# EAGLE design EveryCook_Mainboard (EAGLE 6.4)
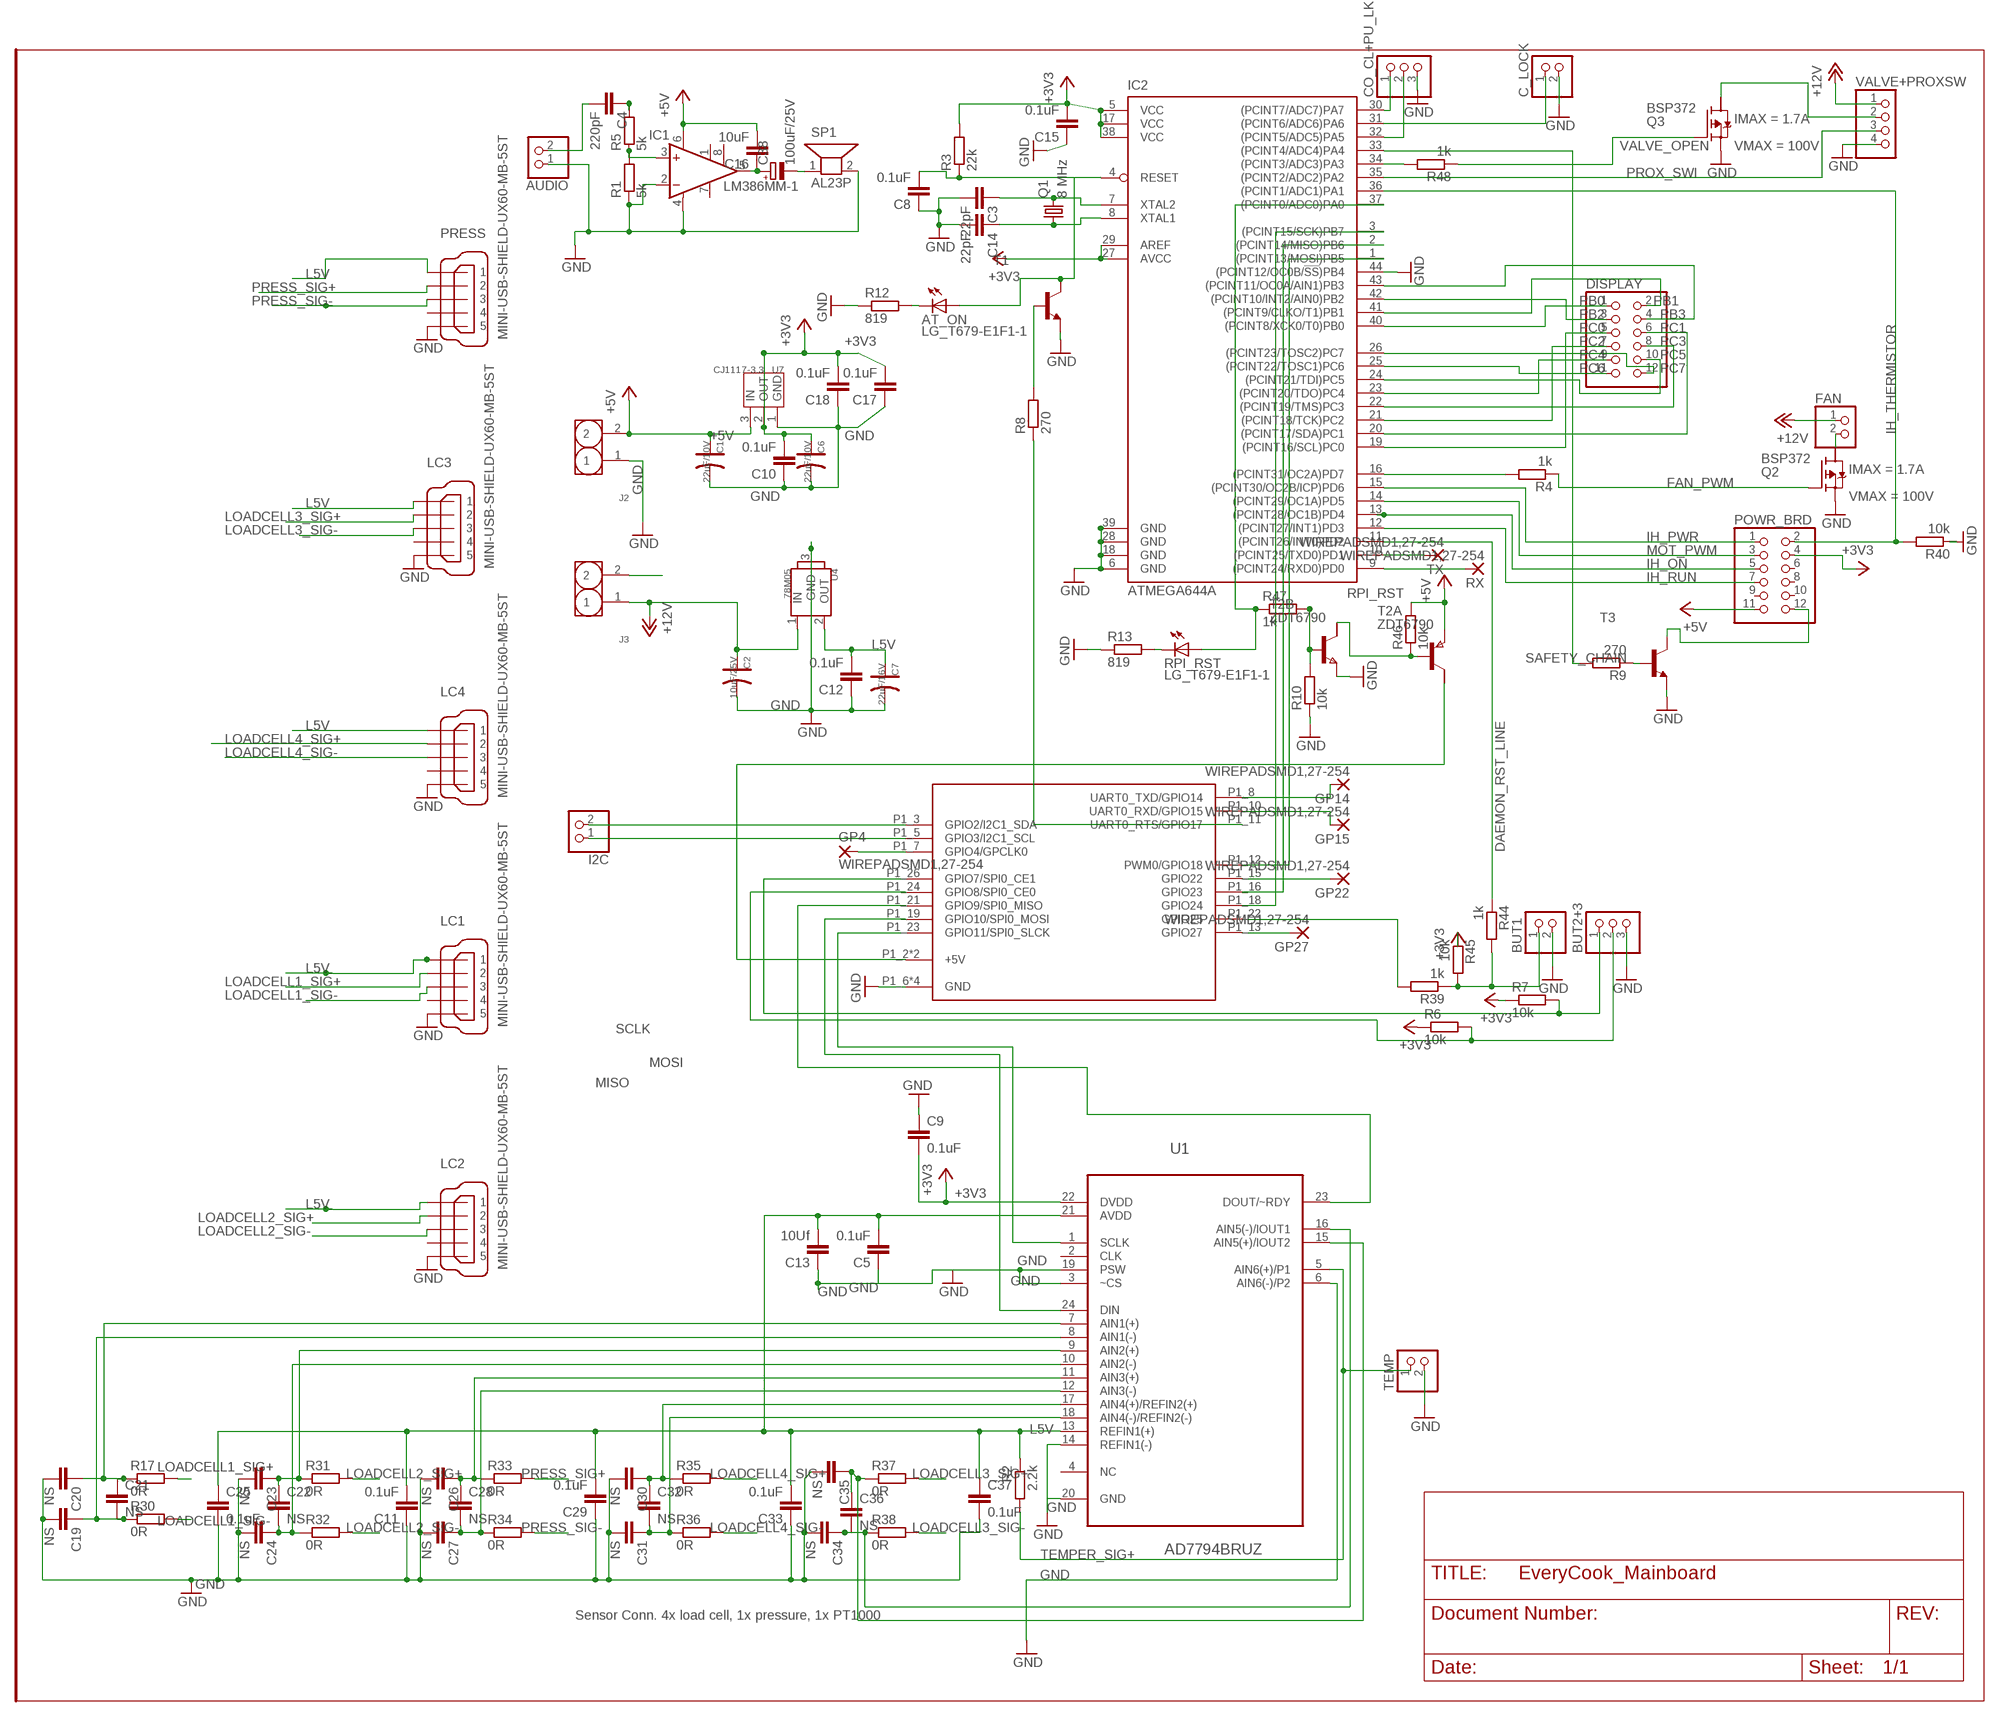
[diagram p0: schematic, sheet 1]

## Parts
AT_ON  LG_T679-E1F1-1  [PLCC2]
AUDIO  PINHD-1X2  [1X02]
BUT1  PINHD-1X2  [1X02]
BUT2+3  PINHD-1X3  [1X03]
C1  22uF/10V  CAP-AVX-A  [AVX-A]
C2  10uF/25V  CAP-ELECTRO-B  [ELECTRO-SMD-B-4.8MM]
C3  22pF  C-EUC0805  [C0805]
C4  220pF  C-EUC0805  [C0805]
C5  0.1uF  C-EUC0805  [C0805]
C6  22uF/10V  CAP-AVX-A  [AVX-A]
C7  22uF/16V  CAP-ELECTRO-B  [ELECTRO-SMD-B-4.8MM]
C8  0.1uF  C-EUC0805  [C0805]
C9  0.1uF  C-EUC0805  [C0805]
C10  0.1uF  C-EUC0805  [C0805]
C11  0.1uF  C-EUC0805  [C0805]
C12  0.1uF  C-EUC0805  [C0805]
C13  10Uf  C-EUC0805  [C0805]
C14  22pF  C-EUC0805  [C0805]
C15  0.1uF  C-EUC0805  [C0805]
C16  10uF  C-EUC0805  [C0805]
C17  0.1uF  C-EUC0805  [C0805]
C18  0.1uF  C-EUC0805  [C0805]
C19  NS  C-EUC0805  [C0805]
C20  NS  C-EUC0805  [C0805]
C21  NS  C-EUC0805  [C0805]
C22  NS  C-EUC0805  [C0805]
C23  NS  C-EUC0805  [C0805]
C24  NS  C-EUC0805  [C0805]
C25  0.1uF  C-EUC0805  [C0805]
C26  NS  C-EUC0805  [C0805]
C27  NS  C-EUC0805  [C0805]
C28  NS  C-EUC0805  [C0805]
C29  0.1uF  C-EUC0805  [C0805]
C30  NS  C-EUC0805  [C0805]
C31  NS  C-EUC0805  [C0805]
C32  NS  C-EUC0805  [C0805]
C33  0.1uF  C-EUC0805  [C0805]
C34  NS  C-EUC0805  [C0805]
C35  NS  C-EUC0805  [C0805]
C36  NS  C-EUC0805  [C0805]
C37  0.1uF  C-EUC0805  [C0805]
C38  100uF/25V  CPOL-EUUD-6,3X7,7  [UD-6,3X7,7_NICHICON]
C_LOCK  PINHD-1X2  [1X02]
CO_CL+PU_LK  PINHD-1X3  [1X03]
DISPLAY  PINHD-2X6  [2X06]
FAN  PINHD-1X2  [1X02]
GP4  WIREPADSMD1,27-254  [SMD1,27-2,54]
GP14  WIREPADSMD1,27-254  [SMD1,27-2,54]
GP15  WIREPADSMD1,27-254  [SMD1,27-2,54]
GP22  WIREPADSMD1,27-254  [SMD1,27-2,54]
GP27  WIREPADSMD1,27-254  [SMD1,27-2,54]
I2C  PINHD-1X2  [1X02]
IC1  LM386MM-1  [MMSOP08]
IC2  ATMEGA644A  [TQFP44]
J2  HEADER-2P-5.0  [2P-5.0]
J3  HEADER-2P-5.0  [2P-5.0]
LC1  MINI-USB-SHIELD-UX60-MB-5ST  [UX60-MB-5ST]
LC2  MINI-USB-SHIELD-UX60-MB-5ST  [UX60-MB-5ST]
LC3  MINI-USB-SHIELD-UX60-MB-5ST  [UX60-MB-5ST]
LC4  MINI-USB-SHIELD-UX60-MB-5ST  [UX60-MB-5ST]
POWR_BRD  PINHD-2X6  [2X06]
PRESS  MINI-USB-SHIELD-UX60-MB-5ST  [UX60-MB-5ST]
Q1  8 MHz  CRYSTALHC49UP  [HC49UP]
Q2  BSP372  BSP613P  [PG-SOT-223]
Q3  BSP372  BSP613P  [PG-SOT-223]
R1  5k  R-EU_R0805  [R0805]
R2  2.2k  R-EU_R0805  [R0805]
R3  22k  R-EU_R0805  [R0805]
R4  1k  R-EU_R0805  [R0805]
R5  5k  R-EU_R0805  [R0805]
R6  10k  R-EU_R0805  [R0805]
R7  10k  R-EU_R0805  [R0805]
R8  270  R-EU_R0805  [R0805]
R9  270  R-EU_R0805  [R0805]
R10  10k  R-EU_R0805  [R0805]
R12  819  R-EU_R0805  [R0805]
R13  819  R-EU_R0805  [R0805]
R17  0R  R-EU_R0805  [R0805]
R30  0R  R-EU_R0805  [R0805]
R31  0R  R-EU_R0805  [R0805]
R32  0R  R-EU_R0805  [R0805]
R33  0R  R-EU_R0805  [R0805]
R34  0R  R-EU_R0805  [R0805]
R35  0R  R-EU_R0805  [R0805]
R36  0R  R-EU_R0805  [R0805]
R37  0R  R-EU_R0805  [R0805]
R38  0R  R-EU_R0805  [R0805]
R39  1k  R-EU_R0805  [R0805]
R40  10k  R-EU_R0805  [R0805]
R44  1k  R-EU_R0805  [R0805]
R45  10k  R-EU_R0805  [R0805]
R46  10k  R-EU_R0805  [R0805]
R47  1k  R-EU_R0805  [R0805]
R48  1k  R-EU_R0805  [R0805]
RPI_RST  LG_T679-E1F1-1  [PLCC2]
RX  WIREPADSMD1,27-254  [SMD1,27-2,54]
SP1  AL23P  [AL23P]
T1  MMBT2222ALT1-NPN-SOT23-BEC  [SOT23-BEC]
T2  ZDT6790  NPN_PNPSM8  [SM8]
T3  MMBT2222ALT1-NPN-SOT23-BEC  [SOT23-BEC]
TEMP  PINHD-1X2  [1X02]
TX  WIREPADSMD1,27-254  [SMD1,27-2,54]
U1  AD7794BRUZ  [SOP65P640X120-24N]
U4  78M05  78M05-TO252  [TO252]
U7  CJ1117-3.3  LD1117SOT89  [SOT89]
U$5  RPI-B-V2  [RPI-B-V2]
VALVE+PROXSW  PINHD-1X4  [1X04]

## Nets
+3V3: C6.+ C9.2 C10.2 C15.2 C17.2 C18.2 IC2.5(VCC) IC2.17(VCC) IC2.27(AVCC) IC2.29(AREF) IC2.38(VCC) POWR_BRD.4 R3.2 R6.1 R7.1 R45.1 U1.22(DVDD) U7.2(OUT) U7.4(TAB)
+5V: C1.+ C16.2 IC1.6(VS) J2.2 POWR_BRD.11 R46.2 T2.1(A:E) U7.3(IN)
+12V: C2.+ FAN.1 J3.1 U4.1(IN) VALVE+PROXSW.1
AT_MISO: IC2.2((PCINT14/MISO)PB6) U$5.P1_16(GPIO23)
AT_MOSI: IC2.1((PCINT13/MOSI)PB5) U$5.P1_12(PWM0/GPIO18)
ATMEL_RST: AT_ON.A C8.2 IC2.4(RESET) R3.1 T1.C
C_CLOSE: CO_CL+PU_LK.1 IC2.30((PCINT7/ADC7)PA7)
DAEMON_RST_LINE: IC2.11((PCINT26/INT0)PD2) R44.1
FAN_PWM: Q2.1(G) R4.1
GND: AUDIO.1 BUT1.2 BUT2+3.3 C1.- C2.- C3.2 C5.1 C6.- C7.- C8.1 C9.1 C10.1 C11.1 C12.1 C13.1 C14.2 C15.1 C17.1 C18.1 C19.2 C20.2 C23.2 C24.2 C25.2 C26.2 C27.2 C29.1 C30.2 C31.2 C33.1 C34.2 C35.2 C37.2 C_LOCK.2 CO_CL+PU_LK.3 IC1.2(-IN) IC1.4(GND) IC2.6(GND) IC2.18(GND) IC2.28(GND) IC2.39(GND) IC2.44((PCINT12/OC0B/!SS!)PB4) J2.1 LC1.5 LC2.5 LC3.5 LC4.5 PRESS.5 Q2.3(S) Q3.3(S) R1.1 R10.1 R12.1 R13.1 R40.1 SP1.2 T1.E T2.3(B:E) T3.E TEMP.2 U1.3(~CS) U1.6(AIN6(-)/P2) U1.14(REFIN1(-)) U1.19(PSW) U1.20(GND) U4.3(GND) U7.1(GND) U$5.P1_6(GND) U$5.P1_14(GND) U$5.P1_20(GND) U$5.P1_25(GND) VALVE+PROXSW.4
IH_ON: IC2.13((PCINT28/OC1B)PD4) POWR_BRD.5
IH_PWR: IC2.15((PCINT30/OC2B/ICP)PD6) POWR_BRD.1
IH_RUN: IC2.12((PCINT27/INT1)PD3) POWR_BRD.7
IH_THERMISTOR: IC2.36((PCINT1/ADC1)PA1) POWR_BRD.2 R40.2
L5V: C5.2 C7.+ C11.2 C12.2 C13.2 C25.1 C29.2 C33.2 C37.1 LC1.1 LC2.1 LC3.1 LC4.1 PRESS.1 R2.1 U1.13(REFIN1(+)) U1.21(AVDD) U4.2(OUT)
LOADCELL1_SIG+: LC1.2 R17.2
LOADCELL1_SIG-: LC1.3 R30.2
LOADCELL2_SIG+: LC2.2 R31.2
LOADCELL2_SIG-: LC2.3 R32.2
LOADCELL3_SIG+: LC3.2 R37.2
LOADCELL3_SIG-: LC3.3 R38.2
LOADCELL4_SIG+: LC4.2 R35.2
LOADCELL4_SIG-: LC4.3 R36.2
MISO: U1.23(DOUT/~RDY) U$5.P1_21(GPIO9/SPI0_MISO)
MOSI: U1.24(DIN) U$5.P1_19(GPIO10/SPI0_MOSI)
MOT_PWM: IC2.14((PCINT29/OC1A)PD5) POWR_BRD.3
N$1: I2C.1 U$5.P1_5(GPIO3/I2C1_SCL)
N$2: C3.1 IC2.7(XTAL2) Q1.2
N$3: C4.1 R5.2
N$5: C34.1 C36.2 R38.1 U1.16(AIN5(-)/IOUT1)
N$6: I2C.2 U$5.P1_3(GPIO2/I2C1_SDA)
N$7: C14.1 IC2.8(XTAL1) Q1.1
N$8: POWR_BRD.12 T3.C
N$9: C20.1 C21.1 R17.1 U1.7(AIN1(+))
N$10: IC2.16((PCINT31/OC2A)PD7) R4.2
N$11: R9.1 T3.B
N$12: IC2.10((PCINT25/TXD0)PD1) TX.1(P)
N$14: IC1.3(+IN) R1.2 R5.1
N$15: IC2.9((PCINT24/RXD0)PD0) RX.1(P)
N$16: GP4.1(P) U$5.P1_7(GPIO4/GPCLK0)
N$17: GP27.1(P) U$5.P1_13(GPIO27)
N$18: GP22.1(P) U$5.P1_15(GPIO22)
N$19: GP15.1(P) U$5.P1_10(UART0_RXD/GPIO15)
N$21: GP14.1(P) U$5.P1_8(UART0_TXD/GPIO14)
N$22: C16.1 C38.+ IC1.5(OUT)
N$23: C38.- SP1.1
N$24: C22.1 C23.1 R31.1 U1.9(AIN2(+))
N$26: R8.2 T1.B
N$27: AUDIO.2 C4.2
N$32: AT_ON.C R12.2
N$34: R13.2 RPI_RST.C
N$42: C22.2 C24.1 R32.1 U1.10(AIN2(-))
N$44: C27.1 C28.2 R34.1 U1.12(AIN3(-))
N$45: C30.1 C32.1 R35.1 U1.17(AIN4(+)/REFIN2(+))
N$46: C31.1 C32.2 R36.1 U1.18(AIN4(-)/REFIN2(-))
N$47: C35.1 C36.1 R37.1 U1.15(AIN5(+)/IOUT2)
N$48: C19.1 C21.2 R30.1 U1.8(AIN1(-))
N$51: FAN.2 Q2.2(D)
N$53: C26.1 C28.1 R33.1 U1.11(AIN3(+))
N$58: T2.8(A:C1) U$5.P1_2(+5V) U$5.P1_4(+5V)
N$60: C_LOCK.1 IC2.31((PCINT6/ADC6)PA6)
N$62: BUT2+3.1 R7.2 U$5.P1_26(GPIO7/SPI0_CE1)
N$63: BUT2+3.2 R6.2 U$5.P1_24(GPIO8/SPI0_CE0)
N$64: R39.2 U$5.P1_22(GPIO25)
N$65: IC2.34((PCINT3/ADC3)PA3) R48.2
N$66: BUT1.1 R39.1 R44.2 R45.2
N$71: R10.2 R47.2 T2.4(B:B)
N$72: R46.1 T2.2(A:B) T2.5(B:C1)
N$77: Q3.2(D) VALVE+PROXSW.2
P_LOCK: CO_CL+PU_LK.2 IC2.32((PCINT5/ADC5)PA5)
PB0: DISPLAY.1 IC2.40((PCINT8/XCK0/T0)PB0)
PB1: DISPLAY.2 IC2.41((PCINT9/CLKO/T1)PB1)
PB2: DISPLAY.3 IC2.42((PCINT10/INT2/AIN0)PB2)
PB3: DISPLAY.4 IC2.43((PCINT11/OC0A/AIN1)PB3)
PC0: DISPLAY.5 IC2.19((PCINT16/SCL)PC0)
PC1: DISPLAY.6 IC2.20((PCINT17/SDA)PC1)
PC2: DISPLAY.7 IC2.21((PCINT18/TCK)PC2)
PC3: DISPLAY.8 IC2.22((PCINT19/TMS)PC3)
PC4: DISPLAY.9 IC2.23((PCINT20/TDO)PC4)
PC5: DISPLAY.10 IC2.24((PCINT21/TDI)PC5)
PC6: DISPLAY.11 IC2.25((PCINT22/TOSC1)PC6)
PC7: DISPLAY.12 IC2.26((PCINT23/TOSC2)PC7)
PGND: J3.2
PRESS_SIG+: PRESS.2 R33.2
PRESS_SIG-: PRESS.3 R34.2
PROX_SWI: IC2.35((PCINT2/ADC2)PA2) VALVE+PROXSW.3
RPI_ATMEL_RST: R8.1 U$5.P1_11(UART0_RTS/GPIO17)
RPI_RST: IC2.37((PCINT0/ADC0)PA0) R47.1 RPI_RST.A
SAFETY_CHAIN: IC2.33((PCINT4/ADC4)PA4) R9.2
SCK: IC2.3((PCINT15/SCK)PB7) U$5.P1_18(GPIO24)
SCLK: U1.1(SCLK) U$5.P1_23(GPIO11/SPI0_SLCK)
TEMPER_SIG+: R2.2 TEMP.1 U1.5(AIN6(+)/P1)
VALVE_OPEN: Q3.1(G) R48.1
Unconnected: IC1.1(GAIN) IC1.7(BYPASS) IC1.8(GAIN) LC1.4 LC1.M1(S1) LC1.M2(S2) LC1.M3(S3) LC1.M4(S4) LC2.4 LC2.M1(S1) LC2.M2(S2) LC2.M3(S3) LC2.M4(S4) LC3.4 LC3.M1(S1) LC3.M2(S2) LC3.M3(S3) LC3.M4(S4) LC4.4 LC4.M1(S1) LC4.M2(S2) LC4.M3(S3) LC4.M4(S4) POWR_BRD.6 POWR_BRD.8 POWR_BRD.9 POWR_BRD.10 PRESS.4 PRESS.M1(S1) PRESS.M2(S2) PRESS.M3(S3) PRESS.M4(S4) Q2.4(D) Q3.4(D) T2.6(B:C2) T2.7(A:C) U1.2(CLK) U1.4(NC)

## Notes on the sheet
- Sensor Conn. 4x load cell, 1x pressure, 1x PT1000

## Library data of the parts
AT_ON RPI_RST = led:*_T679-?-1: LC TOPLED® Low Current LED Source: http://catalog.osram-os.com .. LG_LS_LY_T679_OBS.pdf; COLOR: green
AUDIO BUT1 C_LOCK FAN I2C TEMP = pinhead:PINHD-1X2: PIN HEADER
BUT2+3 CO_CL+PU_LK = pinhead:PINHD-1X3: PIN HEADER
C1 C2 C6 C7 = Discrete:CAP*: Electrolytic Capacitors,Tantalum Capacitors and Super Capacitors
C3-C5 C8-C37 = rcl:C-EU: CAPACITOR, European symbol
C38 = rcl:CPOL-EU: POLARIZED CAPACITOR, European symbol
DISPLAY POWR_BRD = pinhead:PINHD-2X6: PIN HEADER
GP4 GP14 GP15 GP22 GP27 RX TX = wirepad:WIREPAD: Wire PAD connect wire on PCB
IC1 = linear:LM386?-*: Low Voltage Audio Power Amplifier Source: http://cache.national.com/ds/LM/LM386.pdf
IC2 = atmel:ATMEGA644: 8-bit Microcontroller with 64K Bytes In-System Programmable Flash Source: http://www.atmel.com/dyn/resources/prod_documents/doc2593.pdf; MPN: ATMEGA644PV-10AU; OC_FARNELL: 1455123; OC_NEWARK: 58M3748
J2 J3 = Connector:HEADER-2P
LC1-LC4 PRESS = con-hirose:MINI-USB-SHIELD-: MINI USB Connector Source: http://www.hirose.co.jp/cataloge_hp/e24000019.pdf; OC_FARNELL: unknown; OC_NEWARK: unknown
Q1 = crystal:CRYSTAL: CRYSTAL; OC_FARNELL: unknown; OC_NEWARK: unknown
Q2 Q3 = infineon:BSP613P: SIPMOS (R) Small-Signal-Transistor P-Channel (2 Drain) Source: http://www.infineon.com/dgdl/BSP613P_Rev2.4.pdf; IMAX: 1.7A; MF: Infineon; OC_FARNELL: unknown; OC_NEWARK: unknown; VMAX: 100V
R1-R10 R12 R13 R17 R30-R40 R44-R48 = rcl:R-EU_: RESISTOR, European symbol
SP1 = buzzer:AL23P: SPEAKER Source: Buerklin; OC_FARNELL: unknown; OC_NEWARK: unknown
T1 T3 = transistor:*-NPN-: NPN Transistror BF959 corrected 2008.03.06
T2 = zetex:NPN_PNPSM8: Dual NPN TRANSISTOR; OC_FARNELL: unknown; OC_NEWARK: unknown
U1 = analog-devices:AD7794BRUZ: 6-Channel, Low Noise, Low Power, 24-/16-Bit Ó-Ä ADC with On-Chip In-Amp and Reference; MPN: AD7794BRUZ; OC_FARNELL: 1078329; OC_NEWARK: 19M0899; PACKAGE: TSSOP-24; SUPPLIER: Analog Devices
U4 = IC:78M05: 0.5A Three Terminal Positive Voltage Regulators http://pdf1.alldatasheet.com/datasheet-pdf/view/31368/TOSHIBA/78M05/+21_79UPLRhpDDdCDytD+/datasheet.pdf
U7 = IC:LD1117: Low Drop Fixed And Adjustable Positive Voltage Regulators http://www.datasheetcatalog.org/datasheet/SGSThomsonMicroelectronics/mXuqtqv.pdf
U$5 = raspberry_mirr:RPI-B-V2: Second revision of the Model 2 board including the P5 and P6 headers. Mounting holes have been added. Choose the "SHIELD" variant for a predefined Dimension layer and drilling holes. Theres also a "SHIELD" variant for the Model A without a RJ45 connector.
VALVE+PROXSW = pinhead:PINHD-1X4: PIN HEADER

## Board
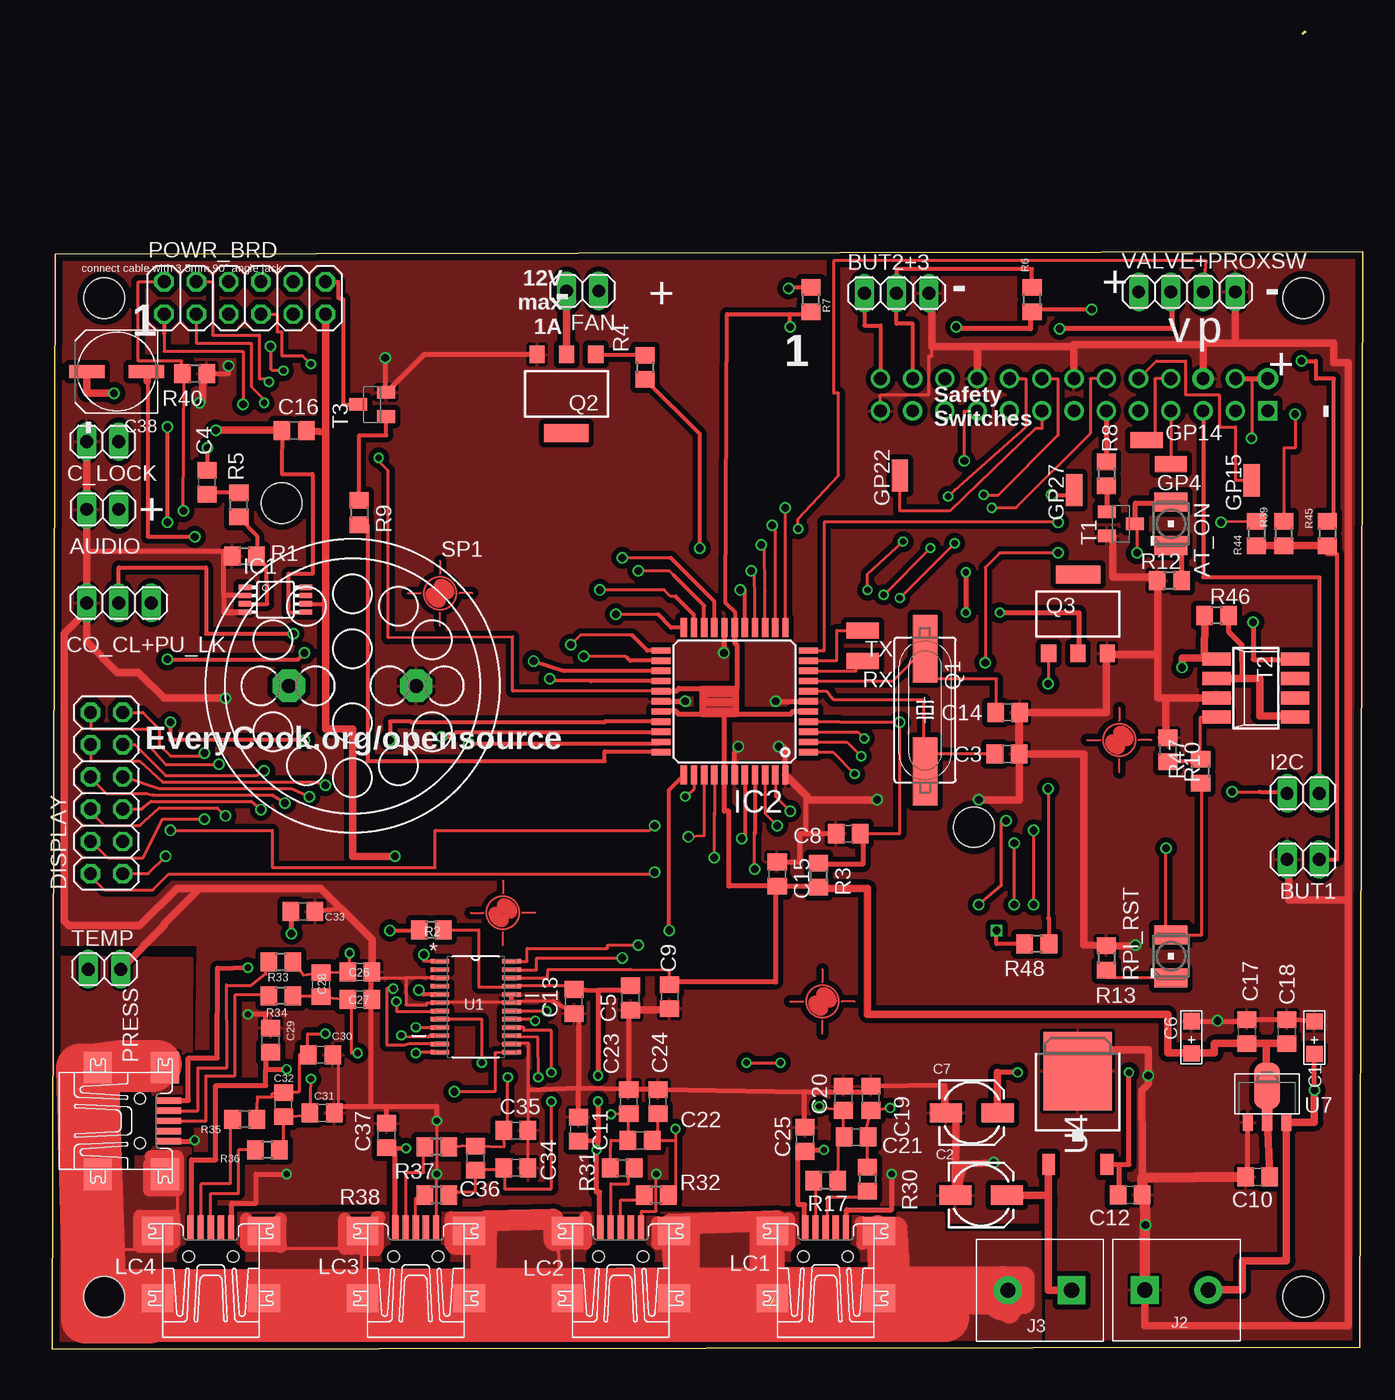
[diagram p1: board, top side]
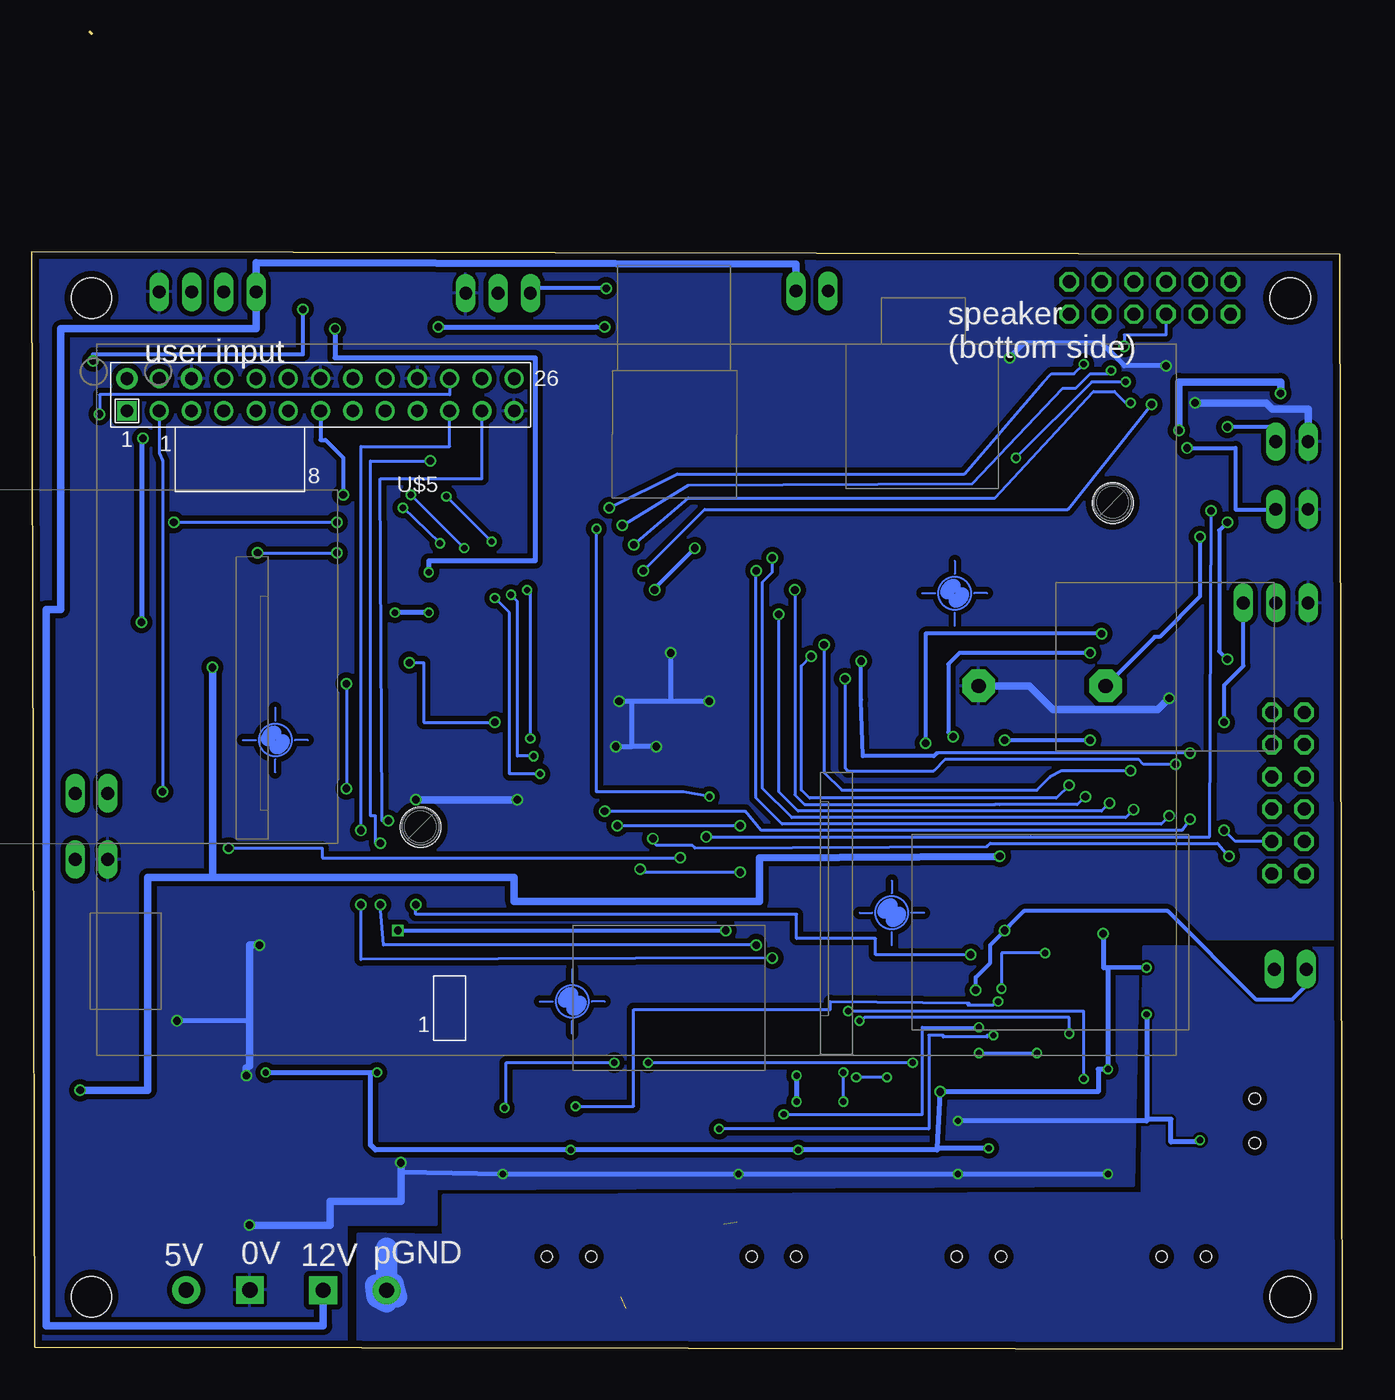
[diagram p2: board, bottom side, seen from below]

Size 103.15 x 103.68 mm. Coordinates in mm from the lower left corner, seen from the top.
Outline: 98.45,103.56 98.58,103.68
Outline: 0.2,86.18 103.15,86.39 102.92,0.13 0,0 0.2,86.18
Copper layers (1*16): Top 0.035mm / dielectric 1.5mm / Bottom 0.035mm
Design rules "default *": minimum track width 7mil, minimum drill 12mil, track to track 8mil, track to pad 8mil, pad to pad 8mil, via to via 8mil, smd to smd 0mil, copper to edge 20mil, drill to drill 10mil, minimum pad ring 10mil, minimum via ring 6mil, stop-mask expansion 2mil, vias tented up to drill 25mil, thermal gap 10mil
Holes 3.2 mm at 4.09,82.73 4.09,4.11 98.45,4.11 98.45,82.73 18.06,66.6 72.54,41.07

### Footprints (pad centres in the part's own frame; a part is rotated, then mirrored left to right if it is on the bottom)
PLCC2 = smd 2.6 x 1.5: A 0,1.7; C 0,-1.7
1X02 = drill 1.016 long: 1 -1.27,0; 2 1.27,0
1X03 = drill 1.016 long: 1 -2.54,0; 2 0,0; 3 2.54,0
AVX-A = smd 1.27 x 1.27: + -1.27,0; - 1.27,0
ELECTRO-SMD-B-4.8MM = smd 2.54 x 1.524: + 2.032,0; - -2.032,0
C0805 = smd 1.3 x 1.5: 1 -0.95,0; 2 0.95,0
UD-6,3X7,7_NICHICON = smd 2.8 x 1: + 2.35,0; - -2.35,0
2X06 = drill 1.016 octagon: 1 -6.35,-1.27; 2 -6.35,1.27; 3 -3.81,-1.27; 4 -3.81,1.27; 5 -1.27,-1.27; 6 -1.27,1.27; 7 1.27,-1.27; 8 1.27,1.27; 9 3.81,-1.27; 10 3.81,1.27; 11 6.35,-1.27; 12 6.35,1.27
SMD1,27-2,54 = smd 1.27 x 2.54: 1 0,0
MMSOP08 = smd 0.41 x 1.02: 1 -0.975,-2.4; 2 -0.325,-2.4; 3 0.325,-2.4; 4 0.975,-2.4; 5 0.975,2.4; 6 0.325,2.4; 7 -0.325,2.4; 8 -0.975,2.4
TQFP44 = smd 1.5 x 0.5: 1 -5.8,4; 2 -5.8,3.2; 3 -5.8,2.4; 4 -5.8,1.6; 5 -5.8,0.8; 6 -5.8,0; 7 -5.8,-0.8; 8 -5.8,-1.6; 9 -5.8,-2.4; 10 -5.8,-3.2; 11 -5.8,-4; 23 5.8,-4; 24 5.8,-3.2; 25 5.8,-2.4; 26 5.8,-1.6; 27 5.8,-0.8; 28 5.8,0; 29 5.8,0.8; 30 5.8,1.6; 31 5.8,2.4; 32 5.8,3.2; 33 5.8,4 | smd 0.5 x 1.5: 12 -4,-5.8; 13 -3.2,-5.8; 14 -2.4,-5.8; 15 -1.6,-5.8; 16 -0.8,-5.8; 17 0,-5.8; 18 0.8,-5.8; 19 1.6,-5.8; 20 2.4,-5.8; 21 3.2,-5.8; 22 4,-5.8; 34 4,5.8; 35 3.2,5.8; 36 2.4,5.8; 37 1.6,5.8; 38 0.8,5.8; 39 0,5.8; 40 -0.8,5.8; 41 -1.6,5.8; 42 -2.4,5.8; 43 -3.2,5.8; 44 -4,5.8
2P-5.0 = drill 1.2 pad 2.184 square: 1 0,0 | drill 1.2 pad 2.184: 2 5,0
UX60-MB-5ST = smd 2 x 0.5: 1 2.25,1.6; 2 2.25,0.8; 3 2.25,0; 4 2.25,-0.8; 5 2.25,-1.6 | smd 2.2 x 2.5: M1 -3.3,-4.2; M2 -3.3,4.2; M3 2,4.2; M4 2,-4.2 | hole 0.9: 0,-1.75; 0,1.75
HC49UP = smd 5.334 x 1.93: 1 -4.826,0; 2 4.826,0
PG-SOT-223 = smd 1.2 x 1.4: 1 -2.311,-3.099; 2 0,-3.099; 3 2.311,-3.099 | smd 3.5 x 1.4: 4 0,3.099
R0805 = smd 1.3 x 1.5: 1 -0.95,0; 2 0.95,0
AL23P = drill 1.118 pad 2.54 octagon: 1 -5.004,0; 2 5.004,0
SOT23-BEC = smd 1 x 1.4: B -0.95,-1.1; C 0,1.1; E 0.95,-1.1
SM8 = smd 1.016 x 2.235: 1 -2.286,-3.099; 2 -0.762,-3.099; 3 0.762,-3.099; 4 2.286,-3.099; 5 2.286,3.099; 6 0.762,3.099; 7 -0.762,3.099; 8 -2.286,3.099
SOP65P640X120-24N = smd 1.473 x 0.356: 1 -2.819,3.581; 2 -2.819,2.921; 3 -2.819,2.286; 4 -2.819,1.626; 5 -2.819,0.965; 6 -2.819,0.33; 7 -2.819,-0.33; 8 -2.819,-0.965; 9 -2.819,-1.626; 10 -2.819,-2.286; 11 -2.819,-2.921; 12 -2.819,-3.581; 13 2.819,-3.581; 14 2.819,-2.921; 15 2.819,-2.286; 16 2.819,-1.626; 17 2.819,-0.965; 18 2.819,-0.33; 19 2.819,0.33; 20 2.819,0.965; 21 2.819,1.626; 22 2.819,2.286; 23 2.819,2.921; 24 2.819,3.581
TO252 = smd 1.016 x 1.651: 1 -2.286,-4.826; 2 2.286,-4.826 | smd 5.4 x 6.2: 3 0,2.5
SOT89 = smd 0.8 x 1.4: 1 -1.524,-1.905; 3 1.524,-1.905 | smd 0.8 x 1.9: 2 0,-1.651 | smd 2.032 x 3.65: 4 0,0.94
RPI-B-V2 = drill 1 square: P1_1 2.54,0 | drill 1 pad 1.676: P1_2 2.54,2.54; P1_6 -2.54,2.54 | drill 1: P1_3 0,0; P1_4 0,2.54; P1_5 -2.54,0; P1_7 -5.08,0; P1_8 -5.08,2.54; P1_9 -7.62,0; P1_10 -7.62,2.54; P1_11 -10.16,0; P1_12 -10.16,2.54; P1_13 -12.7,0; P1_14 -12.7,2.54; P1_15 -15.24,0; P1_16 -15.24,2.54; P1_17 -17.78,0; P1_18 -17.78,2.54; P1_19 -20.32,0; P1_20 -20.32,2.54; P1_21 -22.86,0; P1_22 -22.86,2.54; P1_23 -25.4,0; P1_24 -25.4,2.54; P1_25 -27.94,0; P1_26 -27.94,2.54
1X04 = drill 1.016 long: 1 -3.81,0; 2 -1.27,0; 3 1.27,0; 4 3.81,0

### Placement (x,y rotation side)
AT_ON  88.04,64.95 0 top
AUDIO  3.96,66.09 0 top
BUT1  98.45,38.53 180 top
BUT2+3  66.45,83.11 0 top
C1  99.34,24.51 90 top
C2  73.1,12.12 0 top
C3  75.13,46.84 0 top
C4  12.17,68.22 90 top
C5  45.51,27.64 90 top
C6  89.66,24.54 90 top
C7  72.36,18.59 0 top
C8  62.64,40.56 0 top
C9  48.59,27.75 90 top
C10  94.87,13.56 0 top
C11  41.43,17.32 270 top
C12  84.84,12.14 180 top
C13  41.05,27.36 90 top
C14  75.18,50.11 0 top
C15  57.05,37.39 270 top
C16  19.02,72.29 0 top
C17  94.01,24.99 270 top
C18  97.16,24.99 270 top
C19  64.41,19.74 90 top
C20  62.26,19.74 90 top
C21  63.27,16.69 0 top
C22  46.25,16.43 0 top
C23  45.36,19.48 90 top
C24  47.65,19.48 90 top
C25  59.23,16.51 90 top
C26  24.21,29.69 0 top
C27  24.21,27.53 0 top
C28  21.16,28.68 270 top
C29  17.17,24.31 270 top
C30  21.11,23.16 0 top
C31  21.23,18.59 0 top
C32  18.19,19.23 270 top
C33  19.71,34.44 180 top
C34  36.47,14.27 0 top
C35  36.47,17.2 0 top
C36  33.3,15.04 270 top
C37  26.31,16.81 90 top
C38  5.05,76.94 180 top
C_LOCK  3.96,71.42 180 top
CO_CL+PU_LK  5.23,58.72 180 top
DISPLAY  4.27,43.76 90 top
FAN  41.73,83.29 180 top
GP4  88.04,69.65 90 top
GP14  86.13,71.55 90 top
GP15  94.39,68.38 0 top
GP22  66.7,68.76 0 top
GP27  80.42,67.61 0 top
I2C  98.45,43.74 180 top
IC1  17.55,58.98 270 top
IC2  53.7,50.98 180 top
J2  85.99,4.65 0 top
J3  80.21,4.62 180 top
LC1  60.86,7.29 90 top
LC2  44.73,7.29 90 top
LC3  28.6,7.29 90 top
LC4  12.47,7.29 90 top
POWR_BRD  15.14,82.73 0 top
PRESS  6.88,17.96 0 top
Q1  68.68,50.29 270 top
Q2  40.46,75.18 180 top
Q3  80.72,57.86 0 top
R1  15.11,62.41 0 top
R2  29.82,32.99 180 top
R3  60.3,37.29 270 top
R4  46.63,77.27 270 top
R5  14.68,66.45 90 top
R6  77.11,82.6 90 top
R7  59.72,82.6 90 top
R8  82.96,68.88 270 top
R9  24.16,65.84 270 top
R10  87.78,47.17 270 top
R12  87.91,60.5 0 top
R13  82.96,30.78 270 top
R17  60.86,13.26 180 top
R30  64.16,13.39 270 top
R31  44.86,14.27 0 top
R32  47.52,12.12 180 top
R33  17.98,30.45 180 top
R34  17.98,27.79 180 top
R35  15.14,18.08 180 top
R36  16.92,15.67 180 top
R37  30.25,15.93 180 top
R38  30.25,12.12 180 top
R39  96.93,64.19 90 top
R40  11.2,76.76 180 top
R44  94.77,64.19 270 top
R45  100.36,64.19 270 top
R46  91.64,57.73 180 top
R47  90.37,45.47 90 top
R48  77.48,31.88 180 top
RPI_RST  88.04,30.91 0 top
RX  63.78,54.15 90 top
SP1  23.62,52.2 0 top
T1  84.1,64.95 270 top
T2  94.72,52.02 270 top
T3  25.17,74.35 90 top
TEMP  4.09,29.9 0 top
TX  63.78,56.57 90 top
U1  33.32,26.94 0 top
U4  80.7,19.38 0 top
U7  95.61,19.76 0 top
U$1  [PASS-ROUND]  30.51,59.49 0 top
U$2  [PASS-ROUND]  35.46,34.34 0 top
U$3  [PASS-ROUND]  60.6,27.36 0 top
U$4  [PASS-ROUND]  83.97,47.93 0 top
U$5  93.12,73.84 0 top
VALVE+PROXSW  89.31,83.21 0 top

### Tracks (layer width: path | path; a pad name or v marks a point on that pad's centre or on a via)
+3V3  (via drill 0.5, 0.6)
  Top 0.254: U1.22 38.98,29.22 39.01,29.9 45.49,29.9 48.54,29.84 C9.2 | POWR_BRD.4 12.6,84 12.6,79.81 16.28,79.81 16.28,76.38 16.79,76.38 v17.04,76.12 | IC2.27 36.22,51.78 36.22,56.06 26.44,55.97 26.44,69.14 25.68,69.9 v25.68,70.15 | U7.2 U7.4 | 51.08,51.87 51.21,51.74
  Top 0.305: R45.1 100.86,65.14 100.86,76.38 99.47,76.38 99.47,77.77 v98.32,77.77 | 76.99,80.31 76.99,81.84 v81.81,81.84 | IC2.17 53.75,56.78 53.75,57.96 52.98,58.72 53.11,81.46 58.06,81.46 | 58.06,81.46 59.72,81.46 R7.1 | v58.06,80.44 58.06,81.46
  Top 0.406: IC2.27 49.09,51.78 49.3,51.99 51.08,51.99 51.08,51.87 | 51.08,51.87 51.08,49.96 | 51.08,49.96 49.3,49.96 49.05,50.22 47.93,50.22 IC2.29 | IC2.17 53.7,55.6 53.87,55.42 53.87,51.99 | 53.87,51.99 51.21,51.99 51.08,51.87 | IC2.5 58.28,50.18 58.06,49.96 53.87,49.96 | 53.87,49.96 53.87,51.99 | 52.86,49.96 52.9,49.92 IC2.38 52.9,42.34 53.24,42.34 53.24,36.44 C15.2 | 52.86,49.96 53.87,49.96 | 51.08,49.96 52.86,49.96 | 51.21,50.34 53.75,50.34 53.75,50.72 51.33,50.72 51.33,51.1 53.75,51.1 53.75,51.49 51.33,51.49 51.33,51.36 51.21,51.36 51.21,51.74 53.75,51.74 | C15.2 60.3,36.44 R3.2 | C15.2 56.92,36.44 56.92,28.88 48.59,28.88 C9.2 | R6.1 76.99,81.65 76.99,80.31 71.15,80.31 v71.15,80.44 71.15,80.38
  Top 0.61: U7.2 C10.2 95.82,13.39 | 95.53,24.04 C17.2 91.47,24.04 91.47,23.29 89.66,23.29 | 95.53,24.04 C18.2 | 89.66,23.29 C6.+ | U7.4 95.53,20.7 95.53,24.04 | 89.66,23.29 87.78,23.29 87.78,26.34 64.16,26.34 64.16,36.25 60.3,36.25 R3.2
  Bottom 0.254: v17.04,76.12 19.71,76.12 v25.68,70.15
  Bottom 0.305: v81.81,81.84 81.81,78.28 98.32,78.28 v98.32,77.77 | 58.7,80.44 v58.06,80.44
  Bottom 0.406: v71.15,80.44 58.7,80.44
+5V  (via drill 0.6)
  Top 0.305: IC1.6 21.49,58.65
  Top 0.406: v99.34,20.37 C1.+
  Top 0.61: J2.2 93.65,4.65 93.65,6.93 97.13,6.93 U7.3 99.34,17.86 v99.34,20.37 | R46.2 90.65,54.3 T2.1 91.62,54.41 88.93,54.41 v88.93,53.64 | POWR_BRD.11 21.49,72.16 | 21.49,72.16 21.49,58.65 21.49,48.82 23.65,48.82 23.65,38.79 v26.95,38.79 | C16.2 21.49,72.16
  Bottom 0.61: v88.93,53.64 88.93,37.13 | 88.93,37.13 94.01,37.13 94.01,20.37 v99.34,20.37 | v26.95,38.79 45.87,38.66 45.87,35.23 65.18,35.23 65.18,37.13 88.93,37.13
+12V
  Top 0.61: J3.1 78.41,4.62 U4.1 78.41,14.3 78.38,11.12 78.38,12.12 C2.+
  Bottom 0.61: J3.1 80.21,1.83 102.01,1.83 102.01,58.22 100.86,58.22 100.86,80.31 85.5,80.31 VALVE+PROXSW.1 85.5,85.52 43,85.39 FAN.1
AT_MISO  (via drill 0.5)
  Top 0.254: IC2.2 62.53,47.78 v63.65,46.66 | U$5.P1_16 79.15,76.38 79.15,71.93 74.45,67.23 v73.3,67.23 | v65.43,59.36 v69.11,63.04
  Bottom 0.254: v63.65,46.66 64.92,46.66 64.92,58.85 v65.43,59.36 | v69.11,63.04 v73.3,67.23
AT_MOSI  (via drill 0.5)
  Top 0.254: IC2.1 61.43,46.98 v63.14,45.26 | U$5.P1_12 81.69,76.38 81.69,72.06 75.84,66.22 v73.94,66.22 | v66.7,59.11 v71.02,63.42
  Bottom 0.254: v63.14,45.26 65.56,45.26 65.56,57.96 v66.7,59.11 | v71.02,63.42 v73.94,66.22
ATMEL_RST  (via drill 0.6)
  Top 0.254: IC2.4 61.93,49.38 61.94,49.39 | 61.94,49.39 62,49.33 | T1.C 85.37,64.95 v85.37,62.66 | 63.65,40.56 66.7,40.56 v66.7,49.33 62.06,49.33 61.94,49.39 | v79.15,62.66 74.57,62.66 73.43,61.52 v73.43,54.03
  Top 0.406: T1.C 85.24,64.95 85.24,66.6 88.04,66.6 AT_ON.A | C8.2 63.65,40.56 63.78,40.56 63.78,38.15 60.3,38.15 R3.1
  Bottom 0.254: v85.37,62.66 v79.15,62.66 | v73.43,54.03 72.29,54.03 72.29,49.33 v66.7,49.33
C_CLOSE  (via drill 0.6)
  Top 0.305: IC2.30 43.46,49.38 43.46,49.33 28.22,49.33 28.22,49.38 26.57,49.38 v26.57,47.93 | v19.84,47.93 9.3,47.93 v9.3,49.33
  Bottom 0.305: v26.57,47.93 v19.84,47.93 | v9.3,49.33 9.3,52.25 7.77,53.77 CO_CL+PU_LK.1
DAEMON_RST_LINE  (via drill 0.6)
  Top 0.254: IC2.11 60.67,54.98 | 60.67,54.98 60.73,54.98 60.73,55.04 | 60.67,54.98 60.73,55.04 | R44.1 v91.97,65.07 | v79.15,65.07 60.73,65.07 60.73,55.04
  Bottom 0.254: v91.97,65.07 v79.15,65.07
FAN_PWM
  Top 0.305: R4.1 42.84,78.22 Q2.1
GND  (via drill 0.5, 0.6)
  Top 0.254: v47.52,13.77 47.52,10.85 46.38,10.85 46.38,9.79 LC2.5 | 16.54,13.74 v18.44,13.77 | 15.39,26.41 v15.39,26.34 | v30.25,17.96 v30.25,13.77 30.25,9.79 LC3.5 | C34.2 C35.2 37.49,17.07 37.49,20.37 37.49,24.05 36.14,24.05 U1.14 | 63.91,20.24 C19.2 | C31.2 21.87,19.1 | 25.04,29.36 C26.2 25.18,29.22 | 25.18,29.22 27.84,29.22 | U1.3 27.84,29.22 | 27.84,29.22 27.84,27.1 29.36,27.09 29.49,27.09 29.49,27.23 U1.6 U1.19 | 39.4,27.36 35.97,27.36 | 25.18,29.22 25.04,29.13 C27.2 | C30.2 22.5,23.16 22.5,19.1 | U$5.P1_25 65.18,75.11 68.99,75.11 68.99,78.16 69.24,78.16 69.24,78.92
  Top 0.406: U1.19 U1.20 | v66.07,13.77 66.07,10.97 62.51,10.97 62.51,9.54 LC1.5 | C23.2 41.4,20.5 | 41.4,20.5 37.49,20.37 | C23.2 C24.2 59.21,20.24 | 59.21,20.24 62.76,20.24 | 62.76,20.24 63.91,20.24 | C7.- 70.26,20.75 C19.2 | 21.87,19.1 22.5,19.1 25.04,19.1 | 25.04,19.1 26.31,19.1 | 26.31,19.1 30.25,19.1 v30.25,17.96 | 25.04,29.36 25.04,29.13 25.04,19.1 | C25.2 59.21,17.55 59.21,20.24 | C11.1 41.4,17.73 41.4,20.5 | C29.1 16.79,25.32 16.79,26.34 v15.39,26.34 | C37.2 26.31,19.1 | 41.4,20.5 41.4,26.11 C13.1 39.4,27.36 | C5.1 45.36,26.73 C23.2 | 85.98,12.09 C12.1 | 85.8,13.38 85.8,13.49 | C10.1 94.08,13.87 U7.1 | C1.- 97.68,25.9 | 97.68,25.9 C18.1 | C20.2 62.76,20.24 | PRESS.5 10.82,16.36 v11.2,16.43 | 15.39,26.21 v15.39,26.34 | 15.39,26.39 v15.39,26.34 | LC4.5 14.12,9.79 14.12,11.48 16.03,11.48 16.03,13.77 v18.44,13.77 | IC2.28 v49.81,50.98 | v56.92,50.98 IC2.6 | IC2.18 52.86,56.78 v52.86,54.79 | IC2.44 57.68,45.18 57.68,47.29 57.56,47.42 v57.18,47.42 | IC2.39 53.7,46.99 v54,47.42 | C6.- 91.72,25.81 | 91.72,25.81 94.01,25.81 C17.1 97.68,25.94 97.68,25.9 | v91.72,25.83 91.72,25.81 | 22.44,34.85 22.75,34.63 C33.1 | C15.1 58.83,38.34 58.83,40.56 59.3,40.56 | 59.3,40.56 59.3,43.58 | 59.3,40.56 C8.1 | R40.1 13.87,76.76 v13.87,77.39 | v26.19,78.03 26.19,75.38 T3.E 29.26,78.28 Q2.3 | 13.49,59.3 13.49,58 | IC1.2 13.49,59.3 | 13.49,59.3 13.49,62.53 | 13.49,62.53 14.16,62.53 R1.1 | 13.49,58 IC1.4 15.15,57.96 13.49,57.96 13.49,58 | 13.49,62.53 13.49,62.79 2.69,62.79 2.69,62.66
  Top 0.61: 86.06,4.65 J2.1 85.99,1.83 102.01,1.83 102.01,35.36 | C2.- 71.7,14.43 | C2.- 71.4,11.99 71.4,14.53 v74.09,14.66 | C2.- 71.12,18.62 C7.- 70.18,20.65 | v86.03,9.75 85.99,9.71 | T2.3 87.66,51.26 | 87.66,51.26 87.02,51.26 | 87.02,51.26 87.02,51.23 | 87.02,51.26 87.02,54.66 | 87.02,54.66 83.03,54.66 | 83.03,54.66 Q3.3 | 83.03,54.66 82.96,54.66 82.96,50.11 C14.2 76.1,50.11 | v85.24,31.8 85.24,31.73 R13.1 81.18,31.8 81.18,46.84 C3.2 76.08,50.11 76.1,50.11 | 85.8,13.38 85.8,15.54 85.75,20.37 86.26,20.88 v86.26,21.51 86.26,23.55 81.69,23.55 81.69,21.88 U4.3 | 76.1,50.11 76.1,43.23 v72.92,43.23 | v64.92,43.23 59.64,43.23 59.3,43.58 IC2.44 | C9.1 47.57,26.69 C5.1 | VALVE+PROXSW.4 93.12,79.17 | 93.12,79.17 90.58,79.17 90.58,79.04 | 93.12,79.17 100.86,79.17 100.86,77.65 102.01,77.65 102.01,35.36 | C_LOCK.2 AUDIO.1 2.69,62.66 CO_CL+PU_LK.3 2.69,58.09 | v13.61,51.23 8.79,51.23 6.76,53.26 5.11,53.26 2.69,55.68 2.69,58.09 | C26.2 25.16,32.23 22.75,34.63 | 22.44,34.85 22.63,34.72 21.11,36.25 11.58,36.25 | 11.58,36.25 8.79,33.45 8.79,33.32 TEMP.2 | 11.58,36.25 9.8,36.25 6.88,33.32 1.3,33.32 0.91,33.71 0.91,56.31 2.69,58.09 | U$5.P1_6 90.58,79.04 | 90.58,79.04 80.42,79.04 80.42,78.92 | U$5.P1_14 80.42,78.92 | 80.42,78.92 72.8,78.92 | 72.8,78.92 U$5.P1_20 | BUT2+3.3 69.24,83.11 69.24,78.92 72.8,78.92 | R12.1 87.02,60.5 | 87.02,60.5 87.02,54.66 | T1.E 83.46,64 83.46,60.76 87.02,60.76 87.02,60.5 | BUT1.2 97.31,38.53 97.31,35.36 102.01,35.36 | R10.1 87.66,48.12 87.66,51.26 | R40.1 11.84,76.76 11.84,74.6 11.58,74.6 v11.58,74.47
  Top 0.813: 85.99,9.71 J2.1 | v86.03,9.75 85.98,12.09 | C12.1 85.8,13.38 | 85.8,13.49 C10.1
  Bottom 0.406: 74.07,11.61 74.07,13.89 v66.07,13.77 v47.52,13.77 v30.25,13.77 v18.44,13.77 | v15.39,26.34 15.39,18.08 | 15.39,18.08 15.39,17.96 v30.25,17.96 | v49.81,50.98 52.86,50.98 | 52.86,50.98 55.91,50.98 | 55.91,50.98 v56.92,50.98 | v52.86,54.79 52.86,50.98 | v57.18,47.42 55.91,47.42 | 55.91,47.42 55.91,50.98 | v54,47.42 55.91,47.42 | 86,25.83 v91.72,25.83 | v11.2,16.43 11.2,16.31 13.49,16.31 13.49,18.08 15.39,18.08 | v13.87,77.39 17.17,77.39 18.95,79.17 25.04,79.17 v26.19,78.03
  Bottom 0.61: v74.09,14.66 74.07,11.61 79.68,11.61 79.65,9.75 v86.03,9.75 86.06,9.73 | v85.24,31.8 86,31.8 86,25.83 86,22.28 86.26,22.15 v86.26,21.51 | v72.92,43.23 v64.92,43.23 | SP1.2 24.61,52.2 22.76,50.34 14.5,50.34 v13.61,51.23 | v11.58,74.47 5.99,74.47 5.49,73.96 2.69,73.96 C_LOCK.2
  pour Bottom (isolate 0.406): 78.38,0.56 78.38,9.83 71.27,9.83 71.27,12.62 16.41,12.88 16.03,32.31 0.15,32.31 0.53,85.9 102.77,85.78 102.64,0.56
  pour Top (isolate 0.406): 0.28,31.8 0.79,85.52 0.79,85.9 102.77,85.9 102.51,0.69 78.26,0.69 78.26,9.96 70.76,9.96 70.64,11.35 27.08,11.23 25.93,11.48 11.2,11.35 11.46,31.8
IH_ON  (via drill 0.5, 0.6)
  Top 0.254: IC2.13 56.9,60.66 56.92,64.69 56.92,64.82 v56.67,64.82 | v17.17,78.92 17.17,77.14 17.3,77.01 v18.19,77.01
  Bottom 0.254: POWR_BRD.5 13.87,79.81 17.17,79.81 v17.17,78.92 | v56.67,64.82 51.46,68 29.11,68.12 22,75.62 20.98,75.62 19.84,76.76 18.44,76.76 v18.19,77.01
IH_PWR  (via drill 0.6)
  Top 0.254: IC2.15 55.3,58.95 55.27,61.01 55.27,61.26 v55.02,61.26 | 8.79,79.93 8.79,78.54 15.01,78.54 15.01,74.47 v15.01,74.35
  Top 0.305: POWR_BRD.1 8.79,79.93
  Bottom 0.254: v55.02,61.26 50.19,66.09 21.62,66.09 v15.01,74.35
IH_RUN  (via drill 0.5, 0.6)
  Top 0.254: IC2.12 57.7,61.13 57.68,61.52 v57.68,66.22 | POWR_BRD.7 17.68,81.46 17.68,80.06 18.06,80.06 18.06,78.16 19.71,78.16 v20.35,77.52
  Bottom 0.254: v57.68,66.22 52.35,68.88 29.74,68.88 23.52,76.12 22.89,76.76 21.11,76.76 v20.35,77.52
IH_THERMISTOR  (via drill 0.6)
  Top 0.254: IC2.36 51.3,40.4 v50.06,40.31 | v10.31,65.96 10.38,76.76 R40.2 10.19,77.77 6.76,77.77 6.76,84 POWR_BRD.2
  Bottom 0.254: v50.06,40.31 24.54,40.31 10.44,40.31 v10.31,65.96
L5V  (via drill 0.5 pad 0.25, 0.6)
  Top 0.254: R2.1 33.55,32.99 33.55,28.5 36.14,28.5 U1.21 36.2,28.63 40.54,28.63 C13.2 | U1.13 34.82,23.29 34.82,20.24 v31.65,20.24
  Top 0.406: U4.2 83.01,14.53 83.97,14.53 | 83.97,14.53 84.73,14.53 v84.73,21.77 | v75.97,21.77 74.37,21.77 | C25.1 59.66,15.67 | 59.66,15.67 v60.73,15.67 | C11.2 42.95,16.43 | 42.82,16.56 42.95,16.43 | 42.95,16.43 v42.82,15.67 42.82,12.37 43.08,12.37 43.08,9.79 LC2.1 | 16.79,22.02 16.79,20.75 12.85,20.75 12.85,14.91 10.95,14.91 10.95,9.79 LC4.1 | v27.84,15.8 C37.1 26.95,15.86 26.95,9.79 LC3.1 | v15.39,30.02 15.41,30.02 13,29.97 12.98,22.91 10.69,22.91 10.69,19.56 PRESS.1 | C13.2 42.95,28.24 | 42.95,28.24 v42.95,21.51 | v42.95,19.48 42.95,16.43 | C5.2 45.36,28.24 42.95,28.24 | C12.2 83.97,12.24 83.97,14.53 | v18.82,32.69 18.82,34.19 C33.2 | C29.2 16.79,23.36 16.79,22.02 | 16.79,22.02 v18.44,22.02 | LC1.1 59.21,9.54 59.21,11.35 58.7,11.35 58.7,15.67 59.66,15.67
  Top 0.61: C7.+ 74.37,21.72 74.37,21.77
  Bottom 0.406: v84.73,21.77 76.48,21.77 | 76.48,21.77 v75.97,21.77 | 76.48,21.77 76.48,16.05 76.1,15.67 v60.73,15.67 v42.82,15.67 31.9,15.67 31.9,15.8 | 31.9,15.8 v31.65,20.24 19.2,20.24 19.2,22.02 v18.44,22.02 18.44,30.02 18.79,30.01 | v27.84,15.8 31.9,15.8 | v15.39,30.02 18.79,30.01 | v42.95,21.51 v42.95,19.48 | v18.82,32.69 18.79,30.01
LOADCELL1_SIG+
  Top 0.254: LC1.2 60.1,9.54 60.1,12.75 59.91,12.75 R17.2
LOADCELL1_SIG-
  Top 0.254: 64.16,12.29 R30.2 64.16,11.99 60.99,11.99 60.99,9.54 LC1.3
LOADCELL2_SIG+
  Top 0.254: R31.2 45.36,13.77 45.36,13 43.97,13 43.97,9.79 LC2.2
LOADCELL2_SIG-
  Top 0.254: R32.2 46.38,12.12 46.38,11.73 44.73,11.73 44.73,11.63 44.73,11.61 LC2.3
LOADCELL3_SIG+
  Top 0.254: R37.2 29.24,15.93 29.24,13.89 27.84,13.89 27.84,9.79 LC3.2
LOADCELL3_SIG-
  Top 0.254: 28.98,11.73 28.98,12.12 R38.2 28.6,11.86 LC3.3
LOADCELL4_SIG+
  Top 0.254: R35.2 14,18.08 14,13 11.71,13 11.71,9.79 LC4.2
LOADCELL4_SIG-
  Top 0.254: R36.2 14.63,15.67 14.63,12.24 12.47,12.24 LC4.3
MISO  (via drill 0.6)
  Top 0.254: U1.23 38.13,29.86 38.13,30.78 v44.86,30.78 | v77.24,34.98 v77.24,40.82
  Bottom 0.254: v44.86,30.78 77.24,30.66 v77.24,34.98 | v77.24,40.82 77.24,71.04 70.26,71.04 U$5.P1_21
MOSI  (via drill 0.6)
  Top 0.254: U1.24 37.36,30.52 37.36,31.55 43.71,31.55 43.71,31.8 v46.13,31.8 | v75.72,34.98 v75.72,39.8 | v71.78,69.9 71.78,73.84 U$5.P1_19
  Bottom 0.254: v46.13,31.8 75.46,31.8 v75.72,34.98 | v75.72,39.8 76.1,39.8 76.1,41.96 76.48,41.96 76.48,69.9 v71.78,69.9
MOT_PWM  (via drill 0.5, 0.6)
  Top 0.254: IC2.14 56.1,59.68 56.03,63.04 56.03,63.3 v55.78,63.3 | POWR_BRD.3 11.33,79.17 15.65,79.17 15.65,75.74 16.66,74.73 v16.66,74.47
  Bottom 0.254: v55.78,63.3 51.46,66.98 27.33,66.98 19.58,75.36 17.93,75.36 17.04,74.47 v16.66,74.47
N$1
  Top 0.305: U$5.P1_5 90.58,60.76 99.72,60.76 I2C.1
N$2
  Top 0.254: IC2.7 60.95,51.78 61.37,51.23 61.49,51.1 68.61,51.1 68.61,46.84 68.68,46.84 | C3.1 68.68,46.84 | 68.68,46.84 Q1.2
N$3
  Top 0.305: R5.2 12.4,67.4 C4.1
N$5  (via drill 0.5 pad 0.25)
  Top 0.254: R38.1 31.52,11.86 31.65,12.37 33.3,12.37 C36.2 33.68,14.15 35.08,14.15 35.08,14.27 C34.1 35.59,13.77 35.59,12.62 39.27,12.62 v39.27,19.48 | v39.27,21.77 39.27,25.07 37.11,25.07 37.11,25.32 36.14,25.32 U1.16
  Bottom 0.254: v39.27,19.48 v39.27,21.77
N$6  (via drill 0.6)
  Top 0.254: v92.86,43.87 95.02,43.87
  Top 0.305: 95.02,43.87 97.18,43.87 I2C.2
  Bottom 0.254: U$5.P1_3 93.12,70.54 92.86,69.9 v92.86,43.87
N$7
  Top 0.254: IC2.8 66.14,52.58 Q1.1 68.68,52.76 74.32,52.76 74.32,50.11 C14.1
N$8
  Top 0.305: POWR_BRD.12 22.5,84 22.5,82.73 22.76,82.73 22.76,82.6 22.89,82.6 22.89,74.35 T3.C
N$9  (via drill 0.5 pad 0.25)
  Top 0.254: R17.1 61.87,16.69 C21.1 62.26,16.69 C20.1 60.35,18.97 v60.35,19.1 | v27.08,27.36 27.08,26.59 30.5,26.59 U1.7
  Bottom 0.254: v60.35,19.1 55.78,19.1 55.78,26.72 40.28,26.72 40.28,27.36 29.36,27.23 29.49,27.1 27.46,27.1 v27.08,27.36
N$10  (via drill 0.6)
  Top 0.305: IC2.16 54.51,59.74 v54.13,59.74 | v50.95,63.04 50.95,72 R4.2
  Bottom 0.305: v54.13,59.74 54.13,59.87 v50.95,63.04
N$11
  Top 0.305: R9.1 24.16,71.93 26.27,71.93 T3.B
N$12
  Top 0.254: IC2.10 61.75,54.18 61.75,56.57 TX.1
N$14
  Top 0.305: IC1.3 16.92,58.65 16.92,60.12 16.83,61.65 R1.2 16.15,62.53 16.15,63.93 14.68,65.46 R5.1
N$15
  Top 0.254: IC2.9 63.27,53.38 63.27,54.28 63.78,54.28 RX.1
N$16
  Top 0.254: U$5.P1_7 GP4.1
N$17  (via drill 0.6)
  Top 0.305: v78.64,67.23 80.04,67.23 GP27.1
  Bottom 0.305: U$5.P1_13 80.42,71.55 80.04,71.55 78.64,70.15 v78.64,67.23
N$18
  Top 0.254: U$5.P1_15 77.88,72.44 77.37,72.44 70.64,65.96 66.7,65.96 GP22.1
N$19
  Top 0.254: U$5.P1_10 86.89,77.77 89.18,77.77 89.18,75.11 91.85,75.11 91.85,72.57 93.12,72.57 93.12,68.38 GP15.1
N$21
  Top 0.254: U$5.P1_8 86.77,76.38 86.77,71.42 86.13,71.42 GP14.1
N$22  (via drill 0.6)
  Top 0.305: C16.1 18.06,69.37 18.06,68.88 20.47,68.88 20.47,61.01 18.57,61.01 18.57,57.96 19.95,57.96 IC1.5
  Top 0.61: v12.85,72.31 17.95,72.31 C16.1 | v4.85,75.23 2.7,75.23 C38.+
  Bottom 0.61: v12.85,72.31 12.85,76.12 4.85,76.12 v4.85,75.23
N$23  (via drill 0.6)
  Top 0.305: 7.47,76.17 7.52,76.17 7.52,63.93 v11.2,63.93
  Top 0.61: 7.47,76.17 C38.-
  Bottom 0.305: v11.2,63.93 11.2,59.23 14.38,56.06 14.76,56.06 SP1.1
N$24  (via drill 0.5 pad 0.25)
  Top 0.254: R31.1 43.97,16.43 C22.1 45.36,16.43 C23.1 v43.97,18.47 | v28.6,25.32 30.5,25.32 U1.9
  Bottom 0.254: v43.97,18.47 33.05,18.47 33.05,25.32 v28.6,25.32
N$26
  Top 0.406: R8.2 83,67.93 T1.B
N$27  (via drill 0.6)
  Top 0.305: C4.2 12.22,69.17 v12.22,70.92
  Bottom 0.305: v12.22,70.92 8.41,70.92 8.41,66.09 AUDIO.2
N$32
  Top 0.406: AT_ON.C 88.86,63.25 R12.2
N$34
  Top 0.254: RPI_RST.C 82.96,29.21 R13.2
N$42  (via drill 0.5 pad 0.25)
  Top 0.254: 47.65,16.43 49.05,16.43 | 49.05,16.43 49.05,11.61 R32.1 | C22.2 47.65,16.43 | 47.65,16.43 C24.1 | U1.10 29.62,24.65 29.62,24.56 27.46,24.52 v27.46,24.69 | v49.05,17.32 49.05,16.43
  Bottom 0.254: v27.46,24.69 27.97,24.69 27.97,24.56 31.39,24.56 31.39,24.69 32.54,24.69 32.54,17.32 v49.05,17.32
N$44  (via drill 0.5)
  Top 0.254: R34.1 19.89,27.79 20.85,27.79 20.85,27.74 C28.2 C27.1 23.52,27.53 23.52,23.29 v24.03,23.29 | U1.12 28.6,23.36 v28.6,23.29
  Bottom 0.254: v28.6,23.29 v24.03,23.29
N$45  (via drill 0.5)
  Top 0.254: R35.1 16.15,19.86 17.3,19.86 17.3,20.12 C32.1 18.44,20.24 19.46,20.24 19.46,23.16 C30.1 20.09,23.16 20.09,24.82 v21.49,24.82 | v38,25.83 37.62,25.96 U1.17
  Bottom 0.254: v21.49,24.82 21.49,26.09 37.62,26.09 v38,25.83
N$46  (via drill 0.5)
  Top 0.254: R36.1 18.19,15.67 C32.2 20.35,18.34 C31.1 v20.35,21.26 | v38.89,26.59 36.14,26.59 U1.18
  Bottom 0.254: v20.35,21.26 20.35,26.59 v38.89,26.59
N$47  (via drill 0.5 pad 0.25)
  Top 0.254: R37.1 31.01,15.93 C36.1 35.59,15.93 C35.1 35.84,17.7 v35.84,21.39 | v38.25,21.39 38.21,24.52 36.47,24.56 U1.15
  Bottom 0.254: v35.84,21.39 v38.25,21.39
N$48  (via drill 0.5 pad 0.25)
  Top 0.254: R30.1 64.16,16.69 | C21.2 64.16,16.69 | 64.16,16.69 63.91,16.69 C19.1 v65.94,18.97 | v33.81,22.53 33.81,25.96 U1.8 | v54.64,22.53 v57.3,22.53
  Bottom 0.254: v65.94,18.97 65.81,18.97 65.81,22.53 v57.3,22.53 | v33.81,22.53 v54.64,22.53
N$51
  Top 0.61: Q2.2 FAN.2
N$53  (via drill 0.5)
  Top 0.254: R33.1 19.76,29.44 C28.1 C26.1 23.39,29.44 v23.39,31.17 | v26.82,28.37 26.31,28.37 26.31,23.93 27.71,23.93 28.09,24.05 30.5,24.05 U1.11
  Bottom 0.254: v23.39,31.17 26.82,31.17 v26.82,28.37
N$58  (via drill 0.6)
  Top 0.254: U$5.P1_2 94.39,76.38 v94.39,71.68
  Top 0.406: U$5.P1_4 U$5.P1_2 | v94.51,57.2 94.51,54.28 97.82,54.28 T2.8
  Bottom 0.406: v94.39,71.68 94.51,71.68 v94.51,57.2
N$60  (via drill 0.6)
  Top 0.305: v9.04,72.57 v9.04,65.07 | v9.04,54.28 19.33,54.28 v19.84,54.79 | v30.63,48.18 31.39,48.18 31.78,48.56 47.88,48.56 IC2.31
  Bottom 0.305: C_LOCK.1 5.23,72.57 v9.04,72.57 | v9.04,65.07 9.68,64.44 9.68,54.91 v9.04,54.28 | v19.84,54.79 30.12,54.79 31.01,53.9 31.01,48.56 v30.63,48.18
N$62  (via drill 0.6)
  Top 0.305: BUT2+3.1 63.91,80.57 65.18,80.57 U$5.P1_26 | R7.2 57.94,83.55 v57.94,83.49
  Bottom 0.305: v57.94,83.49 63.91,83.49 BUT2+3.1
N$63
  Top 0.305: R6.2 77.11,85.01 66.45,85.01 BUT2+3.2 66.45,80.7 67.72,80.7 U$5.P1_24
N$64  (via drill 0.6)
  Top 0.254: v97.82,73.58 97.82,70.92 96.93,70.92 R39.2
  Bottom 0.254: U$5.P1_22 70.26,75.11 97.82,75.11 v97.82,73.58
N$65  (via drill 0.6)
  Top 0.305: R48.2 74.32,31.88 v74.32,32.94 | v48.54,32.94 48.54,44.02 IC2.34
  Bottom 0.305: v74.32,32.94 v48.54,32.94
N$66
  Top 0.305: BUT1.1 101.12,38.53 101.12,62.53 100.36,62.53 R45.2
  Top 0.61: R45.2 R39.1 R44.2
N$71
  Top 0.254: T2.4 91.62,49.71 90.32,49.71 90.32,46.23 R47.2
  Top 0.305: 90.32,46.23 87.79,46.23 R10.2
N$72
  Top 0.406: 93.65,52.78 93.62,55.42 92.59,56.45 R46.1
  Top 0.61: T2.2 93.65,52.78 95.02,52.78 95.02,49.83 97.82,49.83 T2.5
N$77  (via drill 0.5, 0.6)
  Top 0.406: VALVE+PROXSW.2 88.16,80.31 v79.27,80.31 | v71.91,61.14 v71.91,57.96 | v74.57,57.96 80.8,57.96 80.8,54.76 Q3.2
  Bottom 0.406: v79.27,80.31 79.27,78.03 63.53,78.03 63.53,62.03 71.91,62.03 v71.91,61.14 | v71.91,57.96 v74.57,57.96
P_LOCK  (via drill 0.6)
  Top 0.305: CO_CL+PU_LK.2 5.23,61.52 12.09,61.52 12.09,56.31 v18.95,56.31 | v32.79,47.68 47.9,47.68 IC2.32
  Bottom 0.305: v18.95,56.31 32.79,56.31 v32.79,47.68
PB0  (via drill 0.6)
  Top 0.254: DISPLAY.1 7.54,37.41 v8.92,38.79 | 54.5,40.45 54.5,40.42 v54.25,40.18
  Top 0.305: IC2.40 54.5,40.45 v54.25,40.18
  Bottom 0.254: v54.25,40.18 54.25,39.93 54,39.67 51.21,39.67 50.95,39.42 27.97,39.55 27.71,39.8 9.8,39.8 v8.92,38.79
PB1  (via drill 0.6)
  Top 0.254: DISPLAY.2 3,37.21 4.09,36.12 7.9,36.12 9.17,37.39 47.27,37.39 v47.4,37.52 | v55.27,37.77 55.27,40.56
  Top 0.305: IC2.41 55.3,40.67 55.27,40.56
  Bottom 0.254: v47.4,37.52 55.02,37.52 v55.27,37.77
PB2  (via drill 0.6)
  Top 0.254: IC2.42 56.1,42.15 v57.05,41.2 | v9.3,40.82 17.3,40.82 17.3,37.9 30.12,37.9 30.12,40.82 47.02,40.82 v47.4,41.2
  Bottom 0.254: v57.05,41.2 v47.4,41.2 | DISPLAY.3 8.43,39.95 v9.3,40.82
PB3  (via drill 0.6)
  Top 0.254: DISPLAY.4 3.05,39.95 4.34,38.66 7.14,38.66 8.66,41.71 v11.96,41.71 | IC2.43 56.9,43.51 v58.06,42.34
  Bottom 0.254: v58.06,42.34 47.02,42.34 45.75,40.82 12.6,40.82 v11.96,41.71
PC0  (via drill 0.6)
  Top 0.254: DISPLAY.5 7.04,42.49 7.77,43.1 15.65,43.1 v16.41,42.47 | v44.86,62.28 48.67,62.28
  Top 0.305: IC2.19 52.1,58.85 48.67,62.28
  Bottom 0.254: v16.41,42.47 17.04,41.83 43.33,41.83 45.62,44.12 45.62,60.38 44.86,61.14 v44.86,62.28
PC1  (via drill 0.6)
  Top 0.254: DISPLAY.6 3,42.29 4.09,41.2 6.88,41.2 8.41,42.6 12.98,42.6 v13.61,41.96 | v46.13,61.26 48.54,61.26 48.92,60.88
  Top 0.305: IC2.20 51.3,58.51 48.92,60.88
  Bottom 0.254: v13.61,41.96 14.25,41.33 44.09,41.33 46.13,43.36 v46.13,61.26
PC2  (via drill 0.6)
  Top 0.254: DISPLAY.7 5.72,45.03 8.41,44.12 18.82,44.12 v20.22,43.48 | 49.05,59.23 48.67,59.23 48.16,59.74 v43.08,59.74
  Top 0.305: IC2.21 50.5,57.78 49.05,59.23
  Bottom 0.254: v20.22,43.48 20.85,42.85 26.95,42.85 27.33,42.85 42.32,42.85 43.08,43.61 v43.08,59.74
PC3  (via drill 0.6)
  Top 0.254: DISPLAY.8 3,44.96 4.22,43.74 7.39,43.74 7.9,43.61 17.3,43.61 v18.31,42.98 | v44.35,57.84 47.65,57.84
  Top 0.305: IC2.22 48.71,56.78 47.65,57.84
  Bottom 0.254: v18.31,42.98 18.95,42.34 42.82,42.34 44.35,43.87 v44.35,57.84
PC4  (via drill 0.6)
  Top 0.254: DISPLAY.9 6.48,47.57 8.92,45.14 16.03,45.14 v16.66,45.52 | 45.62,56.18 41.55,56.18 v40.79,55.42
  Top 0.305: IC2.23 46.83,54.98 45.62,56.18
  Bottom 0.254: v16.66,45.52 22.12,45.52 23.01,45.01 24.03,43.99 39.4,43.99 40.79,45.39 v40.79,55.42
PC5  (via drill 0.6)
  Top 0.254: DISPLAY.10 3,46.35 3.07,46.28 6.88,46.28 8.66,44.63 20.73,44.63 v21.49,44.37 | v41.81,54.53 45.11,54.53 45.24,54.41
  Top 0.305: IC2.24 45.47,54.18 45.24,54.41
  Bottom 0.254: v21.49,44.37 22.5,43.36 41.94,43.36 42.57,43.99 42.57,53.77 v41.81,54.53
PC6  (via drill 0.6)
  Top 0.254: DISPLAY.11 7.11,50.11 8.41,48.82 8.41,47.55 9.3,46.66 11.71,46.66
  Top 0.305: IC2.25 40.3,53.38 v37.87,54.15 | 11.71,46.66 v11.96,46.91
  Bottom 0.254: v11.96,46.91 31.9,46.91
  Bottom 0.305: 31.9,46.91 32.16,46.66 37.74,46.66 37.87,51.1 v37.87,54.15
PC7  (via drill 0.6)
  Top 0.254: DISPLAY.12 3,48.89 3.07,48.82 7.39,48.82 7.65,48.56 7.65,47.42 8.92,46.02 v13.11,46.02 | 39.4,52.63 39.27,52.63 v39.14,52.76
  Top 0.305: IC2.26 42.37,52.58 39.4,52.63
  Bottom 0.254: v13.11,46.02 15.65,46.02 16.03,46.41 31.27,46.41 32.16,45.52 38.89,45.52 39.14,45.77 v39.14,52.76
PGND  (2 unrouted)
  Top 0.254: 39.78,8.56 40.03,3.86 49.81,4.24 49.17,2.84 | 17.93,8.18 17.93,7.92 23.52,7.92 | 25.68,10.34 25.68,7.42 24.28,7.42 24.28,4.44 24.16,4.44 | 33.93,2.72 33.93,8.05 33.05,8.05 | 31.39,8.18 31.39,8.05 32.79,8.05 | 9.8,12.5 9.8,9.96 9.55,9.96 | 6.88,8.05 6.88,7.8 2.57,7.8
  Top 0.305: 63.78,9.96 64.67,9.96 64.92,9.7 | 39.78,8.31 39.78,8.56 | 66.32,2.72 66.32,2.97 66.57,3.23 | 66.83,3.23 66.83,3.61 | 76.48,3.61 76.23,3.61 J3.2 74.83,4.62 | 57.94,8.18 57.68,8.18 57.3,8.56
  Top 1.016: 31.39,8.18 31.39,10.34 34.19,10.34 34.19,10.08 | 25.68,10.34 25.55,10.34 25.55,7.92 23.52,7.92 23.01,7.92 23.01,10.21 | 41.94,10.34 41.94,8.31 39.78,8.31 | 9.17,8.05 6.88,8.05 6.88,10.46 9.55,10.46 9.55,9.96 9.55,8.43 | 7.77,15.16 9.8,15.16 9.8,12.5 7.65,12.5 7.65,14.53 | 15.27,10.21 15.27,8.18 17.93,8.18 | 17.93,8.18 17.93,8.05 | 17.93,8.18 17.93,10.21 | 63.65,9.96 63.78,9.96 63.78,8.31 | 57.94,10.21 57.94,8.18 | 47.65,9.96 47.65,8.31
  Top 1.27: 31.65,8.05 32.79,8.05 33.05,8.05 33.55,8.05 33.55,5.13 32.03,5.13 32.03,5 39.14,5 | 40.41,5 39.14,5 | 39.14,5 39.14,2.84 40.28,2.84 40.28,2.72 | 32.03,2.72 33.93,2.72 | 50.32,9.96 50.32,3.23 56.41,3.23 56.41,2.72 55.52,2.72 55.52,9.83 | 65.05,2.72 66.32,2.72 66.32,4.75
  Top 1.676: 73.69,5.64 76.48,5.64 76.48,3.61 73.94,3.61 73.94,5.13 | 32.28,3.61 34.06,3.61 34.19,10.08 39.4,10.21 39.52,8.56 39.78,8.56 | 49.43,8.31 49.17,2.84 48.79,8.05 48.67,9.83 57.05,10.08 57.3,8.56 56.79,8.18 56.79,4.11 65.05,4.11 64.92,9.7 66.83,3.61 | 66.83,3.61 66.45,9.58 | 66.83,3.61 75.21,4.5 75.34,2.84
  Top 3.81: 8.66,2.46 70.26,2.46 | 66.83,3.23 66.57,3.23 8.79,3.23 | 7.65,2.34 2.57,2.34 2.57,7.8 2.18,22.15 3.2,22.15 | 3.2,22.15 7.9,22.15 8.28,22.4 5.36,22.4 3.2,22.15 | 3.2,22.15 3.33,21.89 3.96,3.1 5.87,3.1 5.61,4.37 24.16,4.44 74.83,4.62 74.96,4.11
  Bottom 0.305: 75.08,4.75 75.09,4.75 J3.2 75.21,7.54
  Bottom 1.676: J3.2 75.21,7.54 75.21,7.92 | 75.08,4.75 75.21,3.73 75.97,4.11 76.1,5 74.7,5.13 74.45,4.11
  pour Bottom: 0.28,31.55 15.65,31.67 15.77,12.24 70.76,12.12 70.76,8.94 77.5,9.07 77.5,0.05 0.15,0.18
  pour Top: 0.53,30.91 10.95,30.78 10.82,10.72 70.13,10.72 70.13,9.19 77.75,9.19 77.75,0.3 0.28,0.3
PRESS_SIG+
  Top 0.254: R33.2 16.84,29.95 16.79,29.51 15.65,28.63 13.71,28.63 13.71,28.66 13.74,23.16 13.74,22.15 11.46,22.15 11.46,18.76 PRESS.2
PRESS_SIG-
  Top 0.254: R34.2 17.02,27.86 14.38,27.86 14.38,21.51 12.09,21.51 12.09,17.96 PRESS.3
PROX_SWI  (via drill 0.5)
  Top 0.254: VALVE+PROXSW.3 90.83,85.65 61.49,85.65 61.49,75.23 61.87,75.23 61.87,68.76 58.7,65.33 v58.7,64.57 | IC2.35 50.5,44.04 v49.81,43.48
  Bottom 0.254: v49.81,43.48 51.84,43.87 58.7,43.87 v58.7,64.57
RPI_ATMEL_RST
  Top 0.406: U$5.P1_11 R8.1
RPI_RST  (via drill 0.6)
  Top 0.254: R47.1 90.45,44.52 90.45,32.56 88.04,32.56 RPI_RST.A 87.66,32.74 v87.66,39.42 | IC2.37 52.1,42.21 | 52.1,42.21 52.1,41.96 | v52.1,38.66 52.1,39.8 52.1,42.21
  Bottom 0.254: v87.66,39.42 80.29,39.42 80.29,38.66 v52.1,38.66
SAFETY_CHAIN
  Top 0.305: IC2.33 47.9,47.04 43.46,47.04 43.46,46.28 24.79,46.28 24.79,64.89 R9.2
SCK  (via drill 0.5)
  Top 0.254: IC2.3 63.28,48.58 63.27,48.56 63.4,48.56 v63.91,48.06 | U$5.P1_18 76.61,76.38 76.61,72.57 71.02,67.61 v70.51,67.11 | v64.16,59.74 64.16,61.01 v66.95,63.55
  Bottom 0.254: v63.91,48.06 63.91,59.49 v64.16,59.74 | v66.95,63.55 v70.51,67.11
SCLK  (via drill 0.6)
  Top 0.254: U1.1 29.24,30.52 v29.24,31.04 | v72.92,34.98 74.7,36.5 74.7,41.58 v75.08,41.58
  Bottom 0.254: v29.24,31.04 36.73,31.04 36.73,32.31 42.95,32.31 42.95,34.21 72.92,34.21 v72.92,34.98 | v75.08,41.58 75.59,41.58 75.59,42.09 75.72,68.5 67.72,68.5 U$5.P1_23
TEMPER_SIG+  (via drill 0.6)
  Top 0.305: v26.57,32.94 28.82,32.94 R2.2 | U1.5 29.2,27.9 v28.85,28.24
  Bottom 0.305: TEMP.1 2.82,28.63 3.96,27.48 6.76,27.48 13.74,34.47 25.04,34.47 26.19,33.32 v26.57,32.94 27.71,31.8 27.71,30.4 28.85,29.26 v28.85,28.24
VALVE_OPEN  (via drill 0.6)
  Top 0.254: Q3.1 78.38,54.76 v78.38,52.37 | v78.38,44.12 78.38,33.91
  Top 0.305: 78.38,33.91 78.43,33.91 R48.1
  Bottom 0.254: v78.38,52.37 v78.38,44.12

### Text on the board
tPlace: 12V / max / 1A | - | + | - | + | - | 1 | 1 | v | p | + | Safety / Switches | - | - | + | EveryCook.org/opensource
bPlace: user input | speaker / (bottom side) | pGND | 12V | 0V | 5V
tNames: connect cable with 3.5mm 90° angle jack